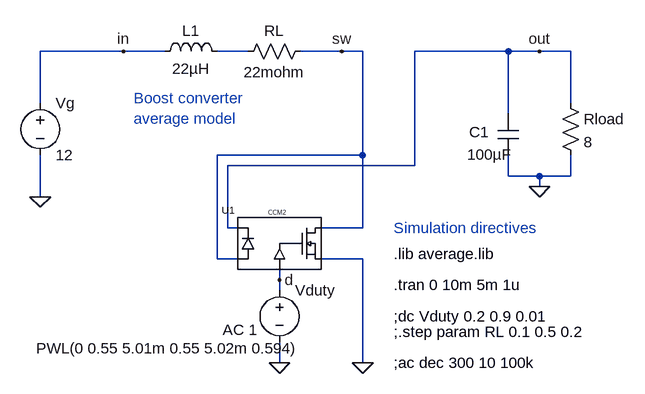
[diagram p0: schematic boost_average.asc]
boost_average.asc, the LTspice schematic file:
Version 4
SHEET 1 1848 680
WIRE 560 -352 432 -352
WIRE 624 -352 560 -352
WIRE 752 -352 704 -352
WIRE 896 -352 832 -352
WIRE 928 -352 896 -352
WIRE 1152 -352 1008 -352
WIRE 1200 -352 1152 -352
WIRE 1248 -352 1200 -352
WIRE 432 -272 432 -352
WIRE 1248 -272 1248 -352
WIRE 1152 -256 1152 -352
WIRE 928 -192 928 -352
WIRE 928 -192 704 -192
WIRE 1008 -176 1008 -352
WIRE 1008 -176 720 -176
WIRE 1152 -160 1152 -192
WIRE 1200 -160 1152 -160
WIRE 1248 -160 1248 -192
WIRE 1248 -160 1200 -160
WIRE 1200 -144 1200 -160
WIRE 432 -128 432 -192
WIRE 720 -80 720 -176
WIRE 736 -80 720 -80
WIRE 928 -80 928 -192
WIRE 928 -80 864 -80
WIRE 704 -32 704 -192
WIRE 736 -32 704 -32
WIRE 928 -32 864 -32
WIRE 800 0 800 -16
WIRE 800 16 800 0
WIRE 800 128 800 96
WIRE 928 128 928 -32
FLAG 800 128 0
FLAG 928 128 0
FLAG 1200 -144 0
FLAG 432 -128 0
FLAG 1200 -352 out
FLAG 896 -352 sw
FLAG 800 0 d
FLAG 560 -352 in
SYMBOL voltage 800 0 R0
WINDOW 3 -374 105 Left 2
WINDOW 123 -87 77 Left 2
WINDOW 39 0 0 Left 2
SYMATTR Value PWL(0 0.55 5.01m 0.55 5.02m 0.594)
SYMATTR Value2 AC 1
SYMATTR InstName Vduty
SYMBOL cap 1136 -256 R0
WINDOW 0 -44 28 Left 2
WINDOW 3 -47 63 Left 2
SYMATTR InstName C1
SYMATTR Value 100µF
SYMBOL res 1232 -288 R0
SYMATTR InstName Rload
SYMATTR Value 8
SYMBOL ind 608 -336 R270
WINDOW 0 32 56 VTop 2
WINDOW 3 5 56 VBottom 2
SYMATTR InstName L1
SYMATTR Value 22µH
SYMBOL res 848 -368 R90
WINDOW 0 0 56 VBottom 2
WINDOW 3 32 56 VTop 2
SYMATTR InstName RL
SYMATTR Value 22mohm
SYMBOL voltage 432 -288 R0
SYMATTR InstName Vg
SYMATTR Value 12
SYMBOL ccm1 800 -48 M0
SYMATTR InstName U1
SYMATTR Value CCM2
SYMATTR SpiceLine Ron=8m
SYMATTR SpiceLine2 VD=0.5 RD=0.05
TEXT 976 8 Left 2 !.tran 0 10m 5m 1u
TEXT 976 -80 Left 2 ;Simulation directives
TEXT 976 -40 Left 2 !.lib average.lib
TEXT 576 -280 Left 2 ;Boost converter\naverage model
TEXT 976 128 Left 2 !;ac dec 300 10 100k
TEXT 976 80 Left 2 !;.step param RL 0.1 0.5 0.2
TEXT 976 56 Left 2 !;dc Vduty 0.2 0.9 0.01

The netlist it stands for:
* boost_average.asc
Vduty d 0 PWL(0 0.55 5.01m 0.55 5.02m 0.594) AC 1
C1 out 0 100µF
Rload out 0 8
L1 in N001 22µH
RL sw N001 22mohm
Vg in 0 12
XU1 sw 0 out sw d CCM2 Ron=8m VD=0.5 RD=0.05  ; pins 1 2 3 4 5
.tran 0 10m 5m 1u
* Simulation directives
.lib average.lib
* Boost converter
* average model
;ac dec 300 10 100k
;.step param RL 0.1 0.5 0.2
;dc Vduty 0.2 0.9 0.01
.backanno
.end